# Altium schematic sheet Transconductance.SchDoc
size A4; SheetNumber: 2; SheetTotal: 3
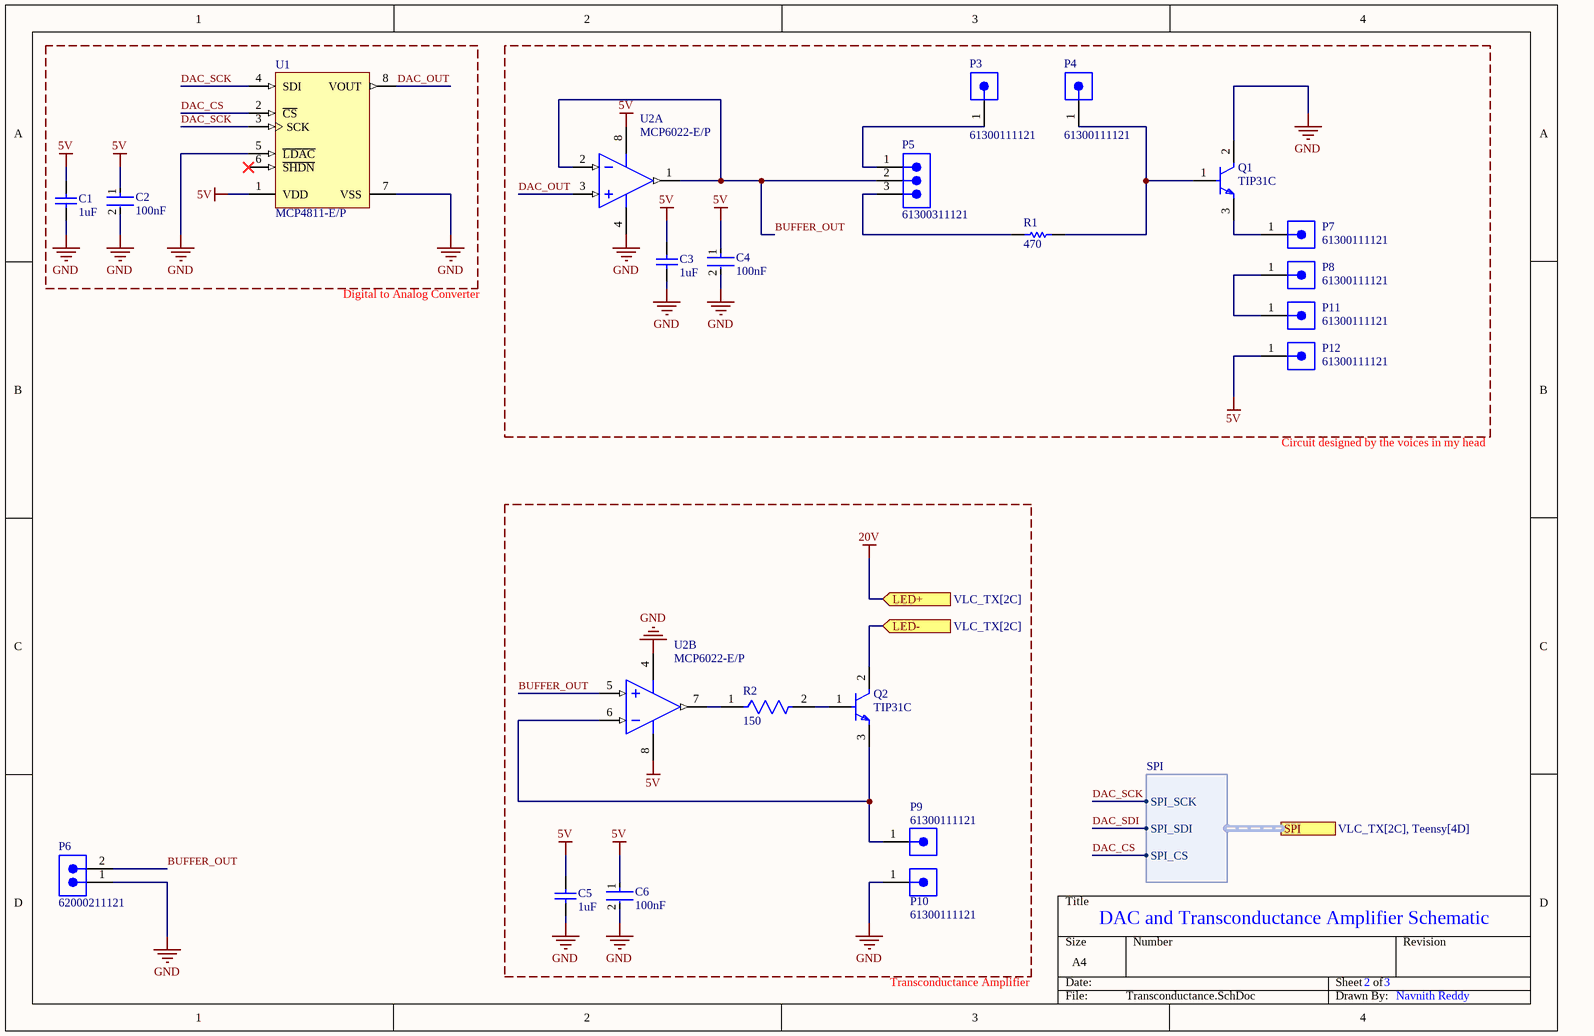
[diagram p0: Transconductance.SchDoc]

## Parts
C1  1uF  [CAPC2013X145X50LL20T25]
C2  100nF  [FP-C0805C-DN-MFG]
C3  1uF  [CAPC2013X145X50LL20T25]
C4  100nF  [FP-C0805C-DN-MFG]
C5  1uF  [CAPC2013X145X50LL20T25]
C6  100nF  [FP-C0805C-DN-MFG]
P3  61300111121  [61300111121]
P4  61300111121  [61300111121]
P5  61300311121  [61300311121]
P6  62000211121  [62000211121]
P7  61300111121  [61300111121]
P8  61300111121  [61300111121]
P9  61300111121  [61300111121]
P10  61300111121  [61300111121]
P11  61300111121  [61300111121]
P12  61300111121  [61300111121]
Q1  TIP31C  [FP-TO-220-P0A0015988-MFG]
Q2  TIP31C  [FP-TO-220-P0A0015988-MFG]
R1  470  [RESC2013X50X30LL20T20]
R2  150  [FP-CRCW0805-e3-IPC_A]
U1  MCP4811-E/P  [PDIP300-P8]
U2  MCP6022-E/P  [PDIP300-P8]  (parts A,B of 2)

## Ports
LED+ (in, see VLC_TX[2C]), LED- (in, see VLC_TX[2C]), SPI (harness SPI, see VLC_TX[2C], Teensy[4D])

## Harnesses
SPI: SPI_SCK, SPI_SDI, SPI_CS

## Nets
5V: C1.2 C2.1 C3.2 C4.1 C5.2 C6.1 P12.1 U1.1(VDD) U2.8(VDD)
20V: port LED+
GND: C1.1 C2.2 C3.1 C4.2 C5.1 C6.2 P6.1 P10.1 Q1.2(C) U1.5(~{LDAC}) U1.7(VSS) U2.4(VSS)
BUFFER_OUT: P5.2 P6.2 U2.1(VOUTA) U2.2(VINA-) U2.5(VINB+)
DAC_CS: U1.2(~{CS}) ; port SPI.SPI_CS
DAC_OUT: U1.8(VOUT) U2.3(VINA+)
DAC_SCK: U1.3(SCK) U1.4(SDI) ; port SPI.SPI_SCK
DAC_SDI: port SPI.SPI_SDI
LED-: Q2.2(C) ; port LED-
NetP3_1: P3.1 P5.1
NetP4_1: P4.1 Q1.1(B) R1.2
NetP5_3: P5.3 R1.1
NetP7_1: P7.1 Q1.3(E)
NetP8_1: P8.1 P11.1
NetP9_1: P9.1 Q2.3(E) U2.6(VINB-)
NetQ2_1: Q2.1(B) R2.2
NetR2_1: R2.1 U2.7(VOUTB)

Not connected (* = marked no-connect by the designer): U1 6(~{SHDN})*

## Notes on the sheet
- Digital to Analog Converter
- Circuit designed by the voices in my head
- DAC and Transconductance Amplifier Schematic
- Transconductance Amplifier
- 2
- 3
- Navnith Reddy

## Library data of the parts
C1 C3 C5 = CMP-1036-04746-2: Manufacturer: Kemet; Part Number: C0805C105K4PACTU
C2 C4 C6 = CMP-2007-00274-2: CAP CER 0.1UF 16V X7R 0805; Manufacturer Part Number: C0805C104K4RACTU; Manufacturer: KEMET; Material: Ceramic; Tolerance: 0.1; Capacitance: 0.10 μF; Value: 0.10 μF; Temperature Coefficient: 30ppm/°C; Device Class L3: Ceramic Capacitors; RoHS: TRUE; Octopart: https://octopart.com/c0805c104k4ractu-kemet-92155; ComponentLink2Description: Datasheet; ComponentLink2URL: https://content.kemet.com/datasheets/KEM_C1003_C0G_SMD.pdf; Temperature Range High: +125°C; Category: Cap; Lead Free: Yes; Digikey Description: CAP CER 0.1UF 16V X7R 0805; Automotive: No; Temperature Range Low: -55°C; Voltage Rating: 16 V; Package: C0805C-DN; Ipc Land Pattern Name: CAPC200125X78; Height: 0.88mm; Device Class L1: Passive Components; Temperature: -55°C to +125°C; Mouser Description: Multilayer Ceramic Capacitors MLCC - SMD/SMT 16volts 0.1uF X7R 10%; Device Class L2: Capacitors; Temperature Characteristic: X7R
P3 P4 P7-P12 = CMP-1502-01058-2: NexarPartId: 32855518; Operating Supply Voltage: 250V; Connector Type: Male Pin; Contact Resistance: 20mΩ; Number of Contacts: 1; Gender: Male; Current Rating: 3A; Contact Mating Length: 5.9944mm; Number of Pins: 1; Lead Pitch: 2.54mm; Contact Plating: Gold; RoHS: Compliant; Termination: Solder; Mount: Through Hole; Number of Rows: 1; Orientation: Vertical; Contact Material: Copper; Packaging: Bulk; REACH SVHC: Unknown; Number of Positions: 1; Color: Black
P5 = CMP-1502-01062-2: NexarPartId: 32855521; Voltage Rating: 250V; Current Rating: 3A; Connector Type: Male Pin; Number of Positions: 3; Gender: Male; Contact Resistance: 20mΩ; Pitch: 2.54mm; Max Operating Temperature: 105°C; Lead Pitch: 2.54mm; Lead Free: Lead Free; Contact Mating Length: 5.9944mm; Contact Material: Copper; Number of Pins: 3; Orientation: Vertical; Height: 8.94mm; Packaging: Bulk; Min Operating Temperature: -40°C; Mount: Through Hole; RoHS: Compliant; Number of Contacts: 3; Operating Supply Voltage: 250V; Termination: Solder; Number of Rows: 1; Contact Plating: Gold; Color: Black; REACH SVHC: Unknown
P6 = CMP-1502-00956-3: NexarPartId: 61924778; Number of Contacts: 2; Voltage Rating: 200V; Gender: Male; Contact Resistance: 20mΩ; Current Rating: 2A; Lead Pitch: 2mm; Max Operating Temperature: 105°C; Contact Material: Gold; Number of Rows: 1; Operating Supply Voltage: 200V; Number of Pins: 2; Orientation: Vertical; Min Operating Temperature: -40°C; Height: 6.35mm; RoHS: Non-Compliant
Q1 Q2 = CMP-12195-000001-1: TRANS NPN 100V 3A TO-220; Manufacturer: STMicroelectronics; Hfe Max: 50; Number Of Npn: 1; Max Junction Temp: +150°C; Standoff Height: 3.5mm; Emitter Base Voltage: 5V; Collector Emitter Saturation Voltage: 1.2V; Power Dissipation: 2W; Hfe Testvce: 4V; Hfe Min: 10; Device Class L2: Transistors; ComponentLink2URL: https://www.st.com/resource/en/datasheet/tip31c.pdf; Device Class L1: Discrete Semiconductors; Digikey Description: TRANS NPN 100V 3A TO-220; Max Collector Current: 3A; RoHS: TRUE; Height: 19.68mm; Mouser Description: Bipolar Transistors - BJT NPN Gen Pur Power; Number Of Elements: 1; Package: TO-220-P0A0015988; Temperature: to +150°C; Octopart: https://octopart.com/tip31c-stmicroelectronics-15555; Manufacturer Part Number: TIP31C; Category: Trans; Hfe Testic: 3A; Lead Free: Yes; Collector Base Voltage: 100V; Device Class L3: BJTs; Collector Emitter Voltage: 100V; Automotive: No; ComponentLink2Description: Datasheet; Temperature Range High: +150°C
R1 = CMP-2001-03932-1: Manufacturer: Vishay Dale; Part Number: CRCW0805470RFKEA
R2 = CMP-2001-04298-2: RES Thick Film, 150Ω, 5%, 0.125W, 200ppm/°C, 0805; Power Rating: 125mW; Voltage Rating (DC): 150V; Resistance: 150R; Case/Package: 0805; Radiation Hardening: No; Packaging: Tape and Reel; Military Standard: Not; Height: 0.02inch; Case Code (Metric): 2012; Min Operating Temperature: -55°C; Contact Plating: Tin; Composition: Thick Film; Termination: SMD/SMT; Lead Free: Lead Free; Tolerance: 5%; Features: Automotive AEC-Q200; Voltage Rating: 150V; Mount: Surface Mount; Weight: 0.000194oz; Number of Terminations: 2; Length: 2mm; Max Power Dissipation: 125mW; Depth: 1.25mm; Package Quantity: 1; Case Code (Imperial): 0805; Max Operating Temperature: 155°C; Temperature Coefficient: 200ppm/°C; Width: 0.049inch
U1 = CMP-0188-01069-1: 10-Bit DACs with Internal VREF and SPI Interface, 8-Pin PDIP, Extended Temperature; ComponentLink3Description: Package Specification; ComponentLink2Description: Datasheet; Code_JEDEC: MS-001; ComponentLink1Description: Manufacturer URL; ComponentLink3URL: http://www.microchip.com/stellent/groups/techpub_sg/documents/packagingspec/en012702.pdf; ComponentLink1URL: http://www.microchip.com/; DatasheetVersion: revB, Apr-2010; PackageReference: PDIP300-P8; PackageVersion: revBB, Aug-2009; ComponentLink2URL: http://ww1.microchip.com/downloads/en/DeviceDoc/22244B.pdf; PackageDescription: 8-Lead Plastic Dual In-Line (P) - 300 mil Body [PDIP]
U2 = CMP-0187-00090-3: None; Max Supply Voltage: 5.5V; Voltage Gain: 110dB; Input Bias Current: 5nA; Bandwidth: 10MHz; Number of Elements: 2; Min Supply Voltage: 2.5V; Input Offset Voltage-Max: 500uV; Power Supply Rejection Ratio (PSRR): 74dB; Nominal Supply Current: 1mA; Input Offset Voltage (Vos): 250uV; Amplifier Type: GENERAL PURPOSE; Common Mode Rejection Ratio: 70dB; Slew Rate-Nom: 7V/µs; Output Current: 22mA; Max Operating Temperature: 125°C; REACH SVHC: No SVHC; Height: 0.195inch; Length: 0.4inch; Min Operating Temperature: -40°C; Mount: Through Hole; Number of Amplifiers: 2; Harmonic Distortion: 0.00053%; Gain Bandwidth Product: 10MHz; RoHS Compliant: Yes; Unity Gain Bandwidth Product: 10MHz; Number of Channels: 2; Radiation Hardening: No; Technology: CMOS; Supply Current: 1mA; Package Quantity: 60; Lead Free: Lead Free; Width: 0.28inch; Slew Rate: 7V/µs; Case/Package: PDIP; Packaging: Rail/Tube; Number of Pins: 8; Number of Circuits: 2